# Altium schematic sheet POWER.SchDoc
size A3
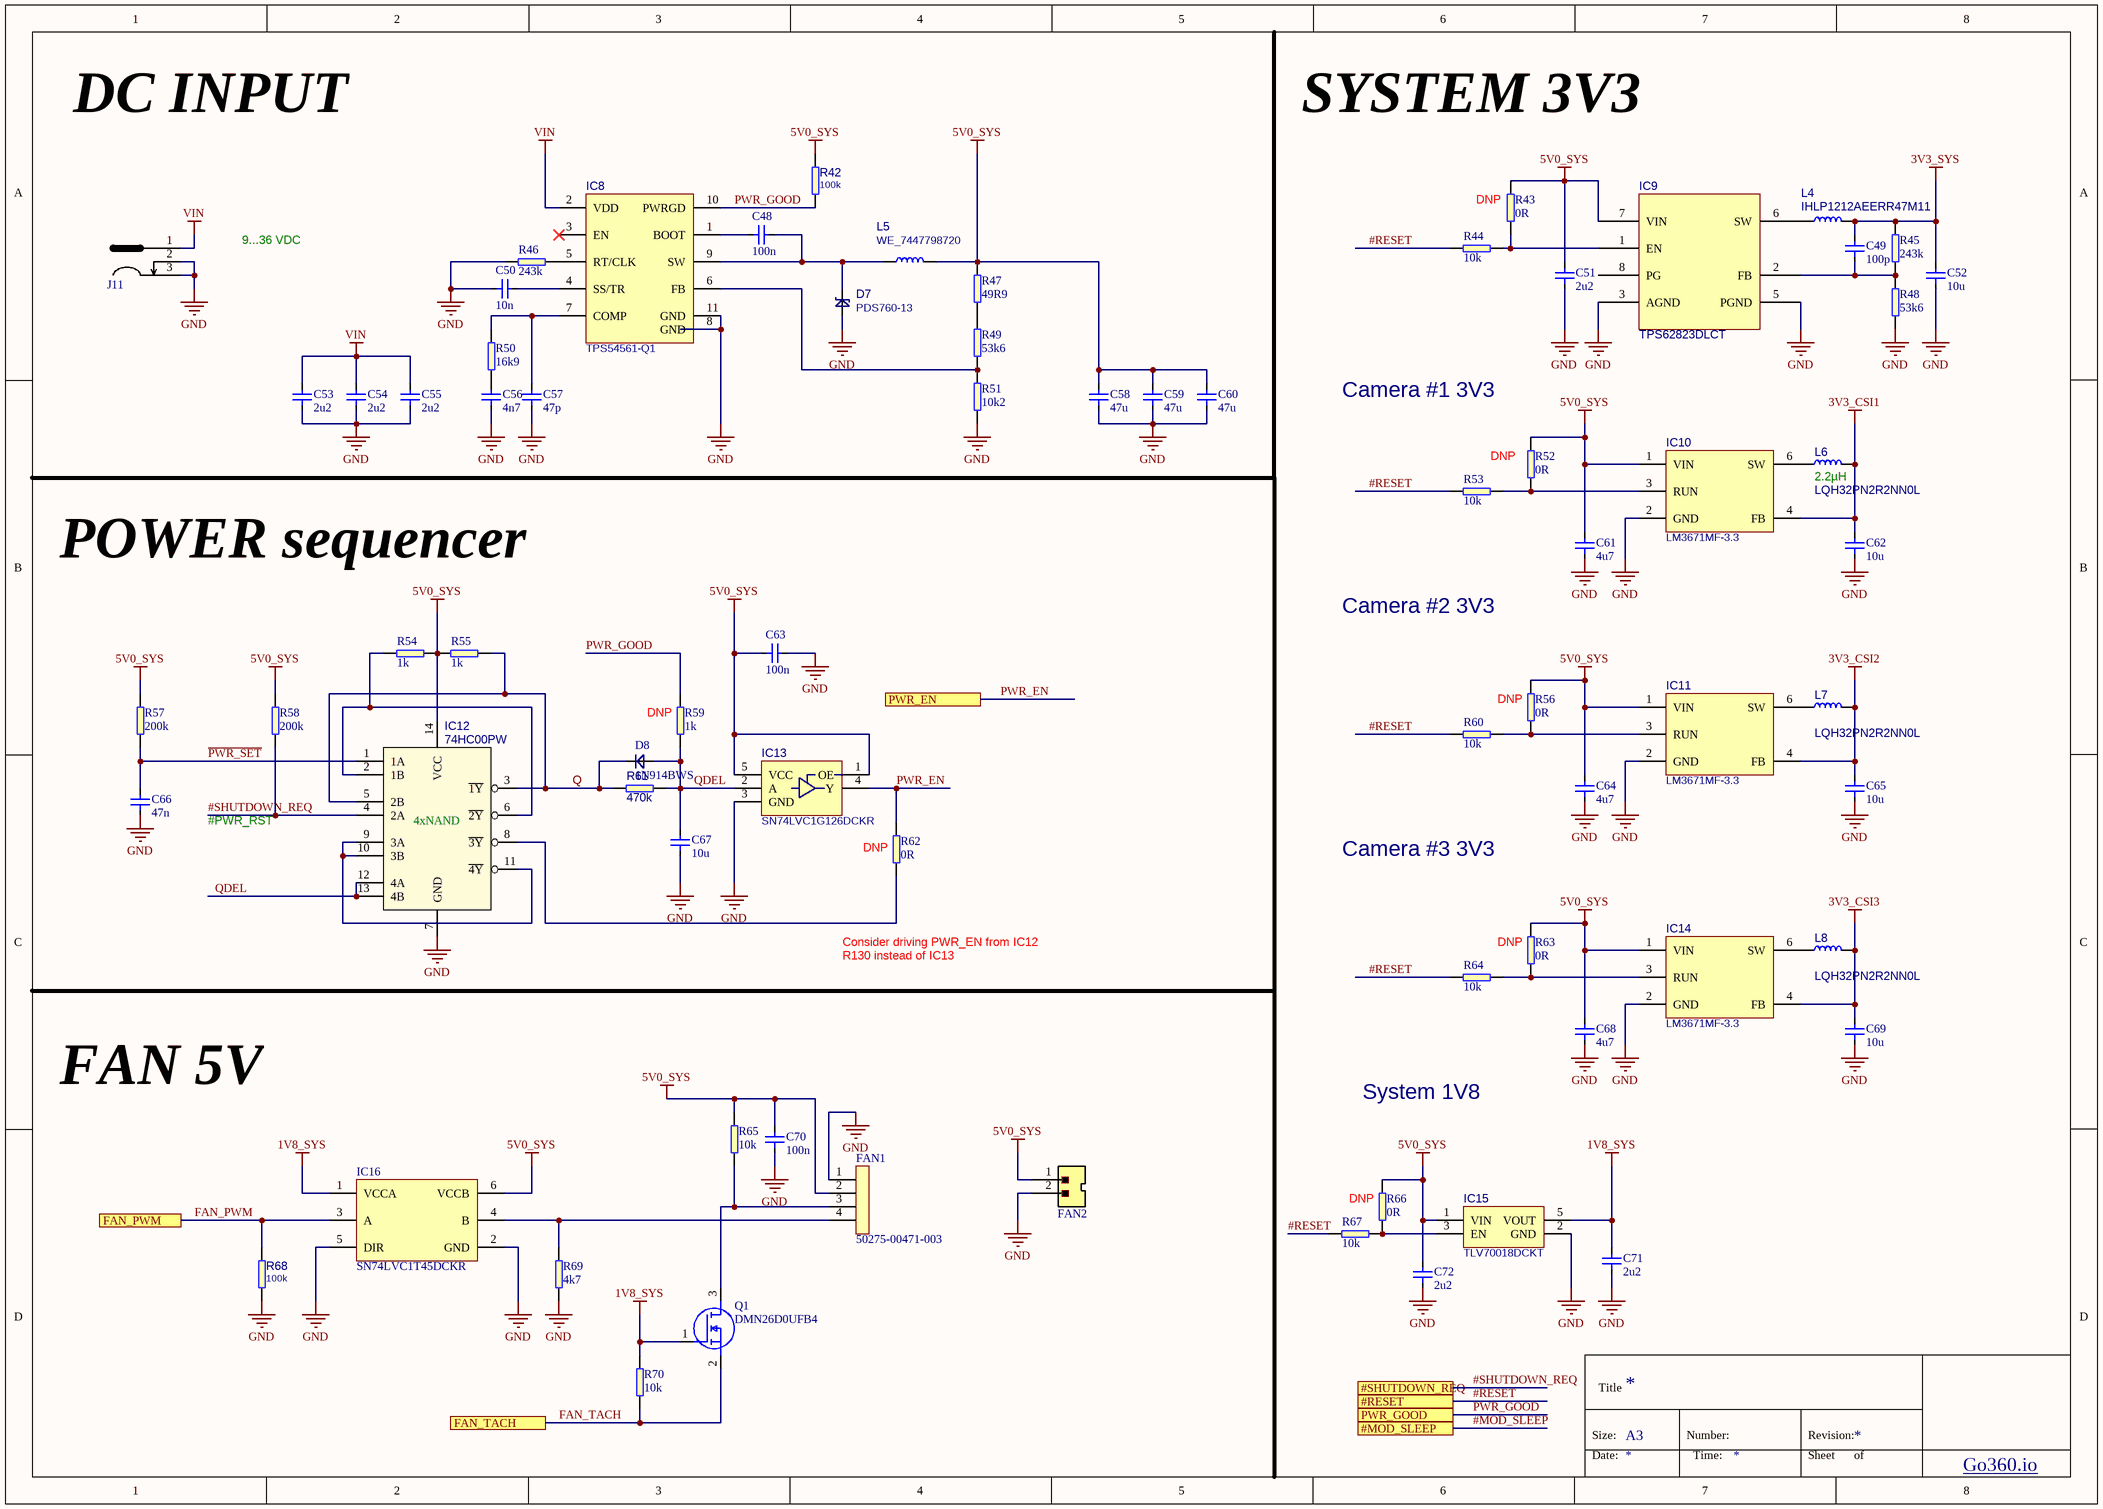
[diagram p0: POWER.SchDoc]

## Parts
C48  100n  [C0402]
C49  100p  [0805]
C50  10n  [C0402]
C51  2u2  [C0402]
C52  10u  [C0603]
C53  2u2  [1206]
C54  2u2  [1206]
C55  2u2  [1206]
C56  4n7  [C0402]
C57  47p  [C0402]
C58  47u  [0805]
C59  47u  [0805]
C60  47u  [0805]
C61  4u7  [C0402]
C62  10u  [C0603]
C63  100n  [C0402]
C64  4u7  [C0402]
C65  10u  [C0603]
C66  47n  [C0402]
C67  10u  [C0603]
C68  4u7  [C0402]
C69  10u  [C0603]
C70  100n  [C0402]
C71  2u2  [C0402]
C72  2u2  [C0402]
D7  PDS760-13  [PowerDI]
D8  1N914BWS  [SOD-323]
FAN1  50275-00471-003  [CON_MISC_004_TH_ST_M_P013_WTB]
FAN2  MX-22-23-2021  [molex_2223-2021]  (value not drawn)
IC8  TPS54561-Q1  [WSON-10_4x4]
IC9  TPS62823DLCT  [TPS62823]
IC10  LM3671MF-3.3  [SOT23-5N]
IC11  LM3671MF-3.3  [SOT23-5N]
IC12  74HC00PW  [TSSOP-14]
IC13  SN74LVC1G126DCKR  [R-PDSO-G5]
IC14  LM3671MF-3.3  [SOT23-5N]
IC15  TLV70018DCKT  [SC70-5]
IC16  SN74LVC1T45DCKR  [SC70_6]
J11  DC-005-5A-2.5  [DC_SOCKET]  (value not drawn)
L4  IHLP1212AEERR47M11  [IHLP-1212AE]
L5  WE_7447798720  [WE_7447798720]
L6  LQH32PN2R2NN0L  [LQH32PN2R2NN0L]
L7  LQH32PN2R2NN0L  [LQH32PN2R2NN0L]
L8  LQH32PN2R2NN0L  [LQH32PN2R2NN0L]
Q1  DMN26D0UFB4  [DMN26D0UFB47]
R42  100k  [R0402]
R43  0R  [R0402]
R44  10k  [R0402]
R45  243k  [R0402]
R46  243k  [R0402]
R47  49R9  [R0402]
R48  53k6  [R0402]
R49  53k6  [R0402]
R50  16k9  [R0402]
R51  10k2  [R0402]
R52  0R  [R0402]
R53  10k  [R0402]
R54  1k  [R0402]
R55  1k  [R0402]
R56  0R  [R0402]
R57  200k  [R0402]
R58  200k  [R0402]
R59  1k  [R0402]
R60  10k  [R0402]
R61  470k  [R0402]
R62  0R  [R0402]
R63  0R  [R0402]
R64  10k  [R0402]
R65  10k  [R0402]
R66  0R  [R0402]
R67  10k  [R0402]
R68  100k  [R0402]
R69  4k7  [R0402]
R70  10k  [R0402]

## Ports
#MOD_SLEEP, #RESET, #SHUTDOWN_REQ, FAN_PWM, FAN_TACH, PWR_EN, PWR_GOOD

## Nets
1V8_SYS: C71.2 IC15.5(VOUT) IC16.1(VCCA) Q1.1(G) R70.2
3V3_CSI1: C62.2 IC10.4(FB) L6.2
3V3_CSI2: C65.2 IC11.4(FB) L7.2
3V3_CSI3: C69.2 IC14.4(FB) L8.2
3V3_SYS: C49.2 C52.2 L4.2 R45.2
5V0_SYS: C51.2 C58.2 C59.2 C60.2 C61.2 C63.1 C64.2 C68.2 C70.2 C72.2 FAN1.2 FAN2.1 IC9.7(VIN) IC10.1(VIN) IC11.1(VIN) IC12.14(VCC) IC13.1(OE) IC13.5(VCC) IC14.1(VIN) IC15.1(VIN) IC16.6(VCCB) L5.2 R42.1 R43.2 R47.2 R52.2 R54.2 R55.1 R56.2 R57.2 R58.2 R63.2 R65.2 R66.2
GND: C50.1 C51.1 C52.1 C53.1 C54.1 C55.1 C56.1 C57.1 C58.1 C59.1 C60.1 C61.1 C62.1 C63.2 C64.1 C65.1 C66.1 C67.1 C68.1 C69.1 C70.1 C71.1 C72.1 D7.A FAN1.1 FAN2.2 IC8.8(GND) IC8.11(GND) IC9.3(AGND) IC9.5(PGND) IC10.2(GND) IC11.2(GND) IC12.7(GND) IC13.3(GND) IC14.2(GND) IC15.2(GND) IC16.2(GND) IC16.5(DIR) J11.2 J11.3 R46.1 R48.1 R51.1 R68.2 R69.1
VIN: C53.2 C54.2 C55.2 IC8.2(VDD) J11.1
#MOD_SLEEP: port #MOD_SLEEP
#RESET: R44.1 R53.1 R60.1 R64.1 R67.1 ; port #RESET
#SHUTDOWN_REQ: IC12.4(2A) R58.1 ; port #SHUTDOWN_REQ
~{PWR_SET}: C66.2 IC12.1(1A) R57.1
FAN_PWM: IC16.3(A) R68.1 ; port FAN_PWM
FAN_TACH: Q1.2(S) R70.1 ; port FAN_TACH
PWR_EN: IC13.4(Y) R62.2 ; port PWR_EN
PWR_GOOD: IC8.10(PWRGD) R42.2 R59.2 ; port PWR_GOOD
Q: D8.C IC12.3(~{1Y}) IC12.5(2B) R55.2 R61.1
QDEL: C67.2 D8.A IC12.12(4A) IC12.13(4B) IC13.2(A) R59.1 R61.2
NetC48_1: C48.1 IC8.1(BOOT)
NetC48_2: C48.2 D7.C IC8.9(SW) L5.1
NetC49_1: C49.1 IC9.2(FB) R45.1 R48.2
NetC50_2: C50.2 IC8.4(SS/TR)
NetC56_2: C56.2 R50.1
NetC57_2: C57.2 IC8.7(COMP) R50.2
NetFAN1_3: FAN1.3 Q1.3(D) R65.1
NetFAN1_4: FAN1.4 IC16.4(B) R69.2
NetIC8_5: IC8.5(RT/CLK) R46.2
NetIC8_6: IC8.6(FB) R49.1 R51.2
NetIC9_1: IC9.1(EN) R43.1 R44.2
NetIC9_6: IC9.6(SW) L4.1
NetIC10_3: IC10.3(RUN) R52.1 R53.2
NetIC10_6: IC10.6(SW) L6.1
NetIC11_3: IC11.3(RUN) R56.1 R60.2
NetIC11_6: IC11.6(SW) L7.1
NetIC12_2: IC12.2(1B) IC12.6(~{2Y}) R54.1
NetIC12_8: IC12.8(~{3Y}) R62.1
NetIC12_9: IC12.9(3A) IC12.10(3B) IC12.11(~{4Y})
NetIC14_3: IC14.3(RUN) R63.1 R64.2
NetIC14_6: IC14.6(SW) L8.1
NetIC15_3: IC15.3(EN) R66.1 R67.2
NetR47_1: R47.1 R49.2

Not connected (* = marked no-connect by the designer): IC8 3(EN)*; IC9 8(PG)

## Notes on the sheet
- DC INPUT
- SYSTEM 3V3
- 9...36 VDC
- (near R43) DNP
- Camera #1 3V3
- DNP
- (near L6) 2.2µH
- POWER sequencer
- Camera #2 3V3
- (near R59) DNP
- (near R56) DNP
- #PWR_RST
- (near R62) DNP
- Camera #3 3V3
- R130 instead of IC13
- Consider driving PWR_EN from IC12
- (near R63) DNP
- FAN 5V
- System 1V8
- Title
- Size:
- Date:
- A3
- Number:
- Time:
- Revision:
- Sheet
- of
- Go360.io
- (in symbol 74HC00PW) 4xNAND

## Library data of the parts
C48 C63 C70 = C_100n_0402: MLCC SMT Capacitor 100n 0402; Manufacturer: TDK; PartSymbol: C1005X5R0J104K050BA; PartNumber: C_100n_0402; Value: 100n
C49 = C_47u_0805: MLCC SMT Capacitor 100pF 0805; PartNumber: C_100p_0805; PartSymbol: 08051A101JAT2A; Value: 100p
C50 = C_10n_0402: MLCC SMT Capacitor 10 nF 0402; Manufacturer: AVX; PartSymbol: 04025G103ZAT2A; PartNumber: C_10n_0402; Value: 10n
C51 C71 C72 = C_2u2_0402: MLCC SMT Capacitor 2.2uF 0402; Manufacturer: TDK; PartSymbol: C1005X5R1A225K050BC; PartNumber: C_2u2_0402; Value: 2u2
C52 C62 C65 C67 C69 = C_10u_0603: MLCC SMT Capacitor 10uF 0603; Manufacturer: Walsin; PartSymbol: 0603X106M6R3CT; PartNumber: C_10u_0603; Value: 10u
C53-C55 = C_2u2_1206: MLCC SMT Capacitor 2.2uF 1206; Manufacturer: KEMET; PartSymbol: C1206C225J5RACTU; PartNumber: C_2u2_1206; Value: 2u2
C56 = C_4n7_0402: MLCC SMT Capacitor 4.7 nF 0402; Manufacturer: TDK; PartSymbol: CGA2B3X7S2A472K050BB; PartNumber: C_4n7_0402; Value: 4n7
C57 = C_47p_0402: MLCC SMT Capacitor 47pF 0402; Manufacturer: KEMET; PartSymbol: C0402C470J5GACTU; PartNumber: C_47p_0402; Value: 47p
C58-C60 = C_47u_0805: MLCC SMT Capacitor 47uF 0805; Manufacturer: KEMET; PartSymbol: C0805C476M9PACTU; PartNumber: C_47u_0805; Value: 47u
C61 C64 C68 = C_4u7_0402: MLCC SMT Capacitor 4.7uF 0402; Manufacturer: MURATA; PartSymbol: GRM155R60G475ME; PartNumber: C_4u7_0402; Value: 4u7
C66 = C_47n_0402: MLCC SMT Capacitor 47nF 0402; Manufacturer: MULTICOMP; PartSymbol: MC0402X473K160CT; PartNumber: C_47n_0402; Value: 47n
D7 = Diode Schottky: DIODE SCHOTTKY 60V 7A POWERDI5; Manufacturer: DIODES INC.; PartNumber: PDS760-13; Value: PDS760-13; PartSymbol: PDS760-13
D8 = diode: Diode small signal; Manufacturer: ON SEMICONDUCTOR; PartNumber: 1N914BWS; Value: 1N914BWS; PartSymbol: 1N914BWS
FAN2 = molex_2223-2021: Pinhead connector with key; Manufacturer: Molex; PartSymbol: 022232021 A-6373-02A222; Value: MX-22-23-2021; PartNumber: molex_2223-2021
IC8 = TPS54561: IC REG BCK SPLIT RAIL ADJ 10WSON; Manufacturer: TEXAS INSTRUMENTS; PartNumber: TPS54561-Q1; Value: TPS54561-Q1; PartSymbol: TPS54561-Q1
IC9 = TPS62823: IC REG BUCK ADJ 1A 8VSON-HR; Manufacturer: TEXAS INSTRUMENTS; PartNumber: TPS62823; Value: TPS62823DLCT; PartSymbol: TPS62823DLCT; Class: IC
IC10 IC11 IC14 = LM3671: DC/DC Buck Converter; Manufacturer: TEXAS INSTRUMENTS; PartSymbol: LM3671MF-3.3/NOPB; Value: LM3671MF-3.3; PartNumber: LM3671MF-3.3
IC12 = 74HC00PW: 2 NAND Gate, 4 channel; Manufacturer: NEXPERIA; PartNumber: 74HC00PW; Value: 74HC00PW; PartSymbol: 74HC00PW
IC13 = SN74LVC1G126: Buffer, tri-state; Manufacturer: Texas Instruments; PartNumber: SN74LVC1G126DCKR; Value: SN74LVC1G126DCKR; PartSymbol: SN74LVC1G126DCKR
IC15 = TLV700: Voltage Regulator, 2V to 5.5V, 175mV Dropout, 1.8Vout, 200mAout; Manufacturer: TEXAS INSTRUMENTS; Value: TLV70018DCKT; PartNumber: TLV70018DCKT; PartSymbol: TLV70018DCKT
J11 = DC_SOCKET: DC Power Connector, Jack, 4 A, 1.95 mm, PCB Mount, Through Hole; Manufacturer: XKB Connectivity; PartNumber: DC-005-5A-2.5; PartSymbol: DC-005-5A-2.5; Value: DC-005-5A-2.5
L4 = IHLP1212AEERR47M11: FIXED IND 470NH 6.7A 15 MOHM SMD; Manufacturer: VISHAY; Class: Inductance; PartNumber: IHLP1212AEERR47M11; Value: IHLP1212AEERR47M11; PartSymbol: IHLP1212AEERR47M11; Inductance: 470nH; RatedCurrent: 6.7A
L5 = WE_7447798720: Fixed Inductors WE-PDF 1064 7.2uH 7.9A 12.8mOhm; Manufacturer: WURTH ELEKTRONIK; PartNumber: WE_7447798720; Value: WE_7447798720; PartSymbol: 7447798720; Inductance: 7.2uH; RatedCurrent: 7.9A
L6-L8 = LQH32PN2R2NN0L: INDUCTOR, 2.2 ?H, ? 30%, 1212, 90 MHz, 0.073 ohm; Manufacturer: MURATA; Inductance: 2.2uH; PartNumber: LQH32PN2R2NN0L; Value: LQH32PN2R2NN0L; PartSymbol: LQH32PN2R2NN0L
Q1 = DMN26D0UFB4: MOSFET (N-Channel); Manufacturer_Name: Diodes Inc.; Manufacturer_Part_Number: DMN26D0UFB4-7; Datasheet Link: https://componentsearchengine.com/Datasheets/1/DMN26D0UFB4-7.pdf; Height: 0.4mm; Arrow Part Number: DMN26D0UFB4-7; Arrow Price/Stock: https://www.arrow.com/en/products/dmn26d0ufb4-7/diodes-incorporated; Mouser Part Number: 621-DMN26D0UFB4-7; Mouser Price/Stock: https://www.mouser.co.uk/ProductDetail/Diodes-Incorporated/DMN26D0UFB4-7?qs=GWgl%252BsiMZr%252B4pznsTuF3iQ%3D%3D
R42 R68 = R_100k_0402: SMT Resistor 100k 0402; Manufacturer: VISHAY; PartSymbol: CRCW0402100KFKEDHP; Tolerance: 1%; PartNumber: R_100k_0402; Value: 100k
R43 R52 R56 R62 R63 R66 = R_0R_0402: RES, 0R, 0402; Manufacturer: Panasonic; PartSymbol: ERJ2GE0R00X; PartNumber: R_0R_0402; Value: 0R
R44 R53 R60 R64 R65 R67 R70 = R_10k_0402: RES, 10k, 0402; Manufacturer: MULTICOMP; PartSymbol: MCMR04X1002FTL; PartNumber: R_10k_0402; Value: 10k
R45 R46 = R_243k_0402: RES, 243k, 0402; Manufacturer: MULTICOMP; PartSymbol: MCMR04X2433FTL; PartNumber: R_243k_0402; Value: 243k
R47 = R_49R9_0402: RES, 49R9, 0402; Manufacturer: VISHAY; PartSymbol: CRCW040249R9FKED; PartNumber: R_49R9_0402; Value: 49R9
R48 R49 = R_53k6_0402: RES, 53k6, 0402; Manufacturer: TE CONECTIVITY; PartSymbol: CPF0402B53K6E1; PartNumber: R_53k6_0402; Value: 53k6
R50 = R_16k9_0402: RES, 16k9, 0402; Manufacturer: Panasonic; PartSymbol: ERA2AEB1692X; PartNumber: R_16k9_0402; Value: 16k9
R51 = R_10k2_0402: RES, 10k2, 0402, 0.1%; PartNumber: R_10k2_0402_0.1%; Manufacturer: TE CONECTIVITY; PartSymbol: CPF0402B10K2E1; Tolerance: 0.1%; Value: 10k2
R54 R55 R59 = R_1k_0402: RES, 1k, 0402; Manufacturer: BOURNS; PartSymbol: CR0402-FX-1001GLF; PartNumber: R_1k_0402; Value: 1k
R57 R58 = R_200k_0402: RES, 200k, 0402; Manufacturer: YAGEO; PartSymbol: RC0402FR-07200KL; PartNumber: R_200k_0402; Value: 200k
R61 = R_470k_0402: SMT Resistor 470k 0402; Manufacturer: VISHAY; PartSymbol: CRCW0402470KFKED; PartNumber: R_470k_0402; Value: 470k
R69 = R_4k7_0402: RES, 4k7, 0402; Manufacturer: Panasonic; PartSymbol: ERJ2GEJ472X; PartNumber: R_4k7_0402; Value: 4k7